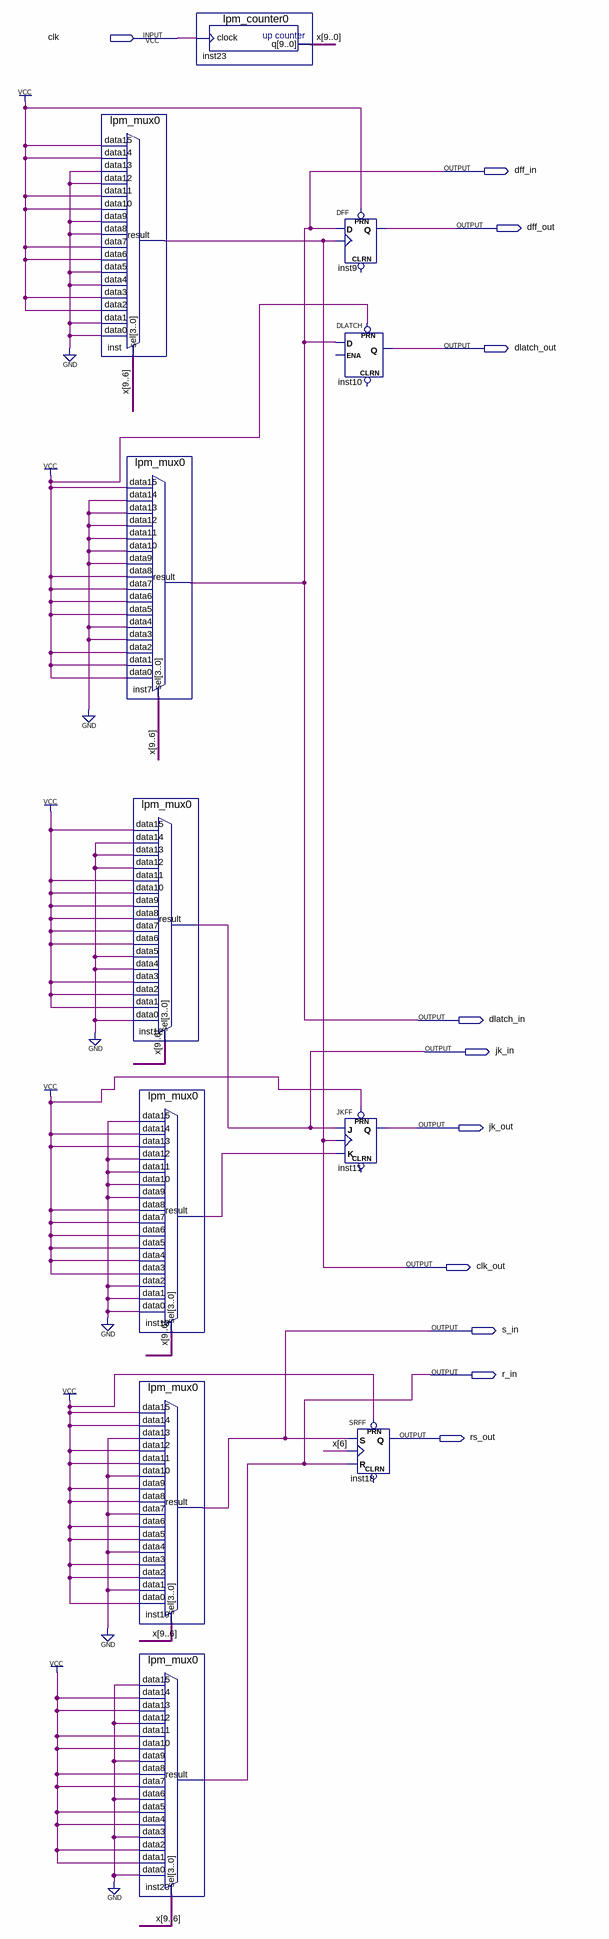
[diagram p0: schematic sheet]
// Quartus schematic Laba_4.bdf as structural Verilog: 11 symbols, 11 pins
module Laba_4 (
  input  clk,
  output dff_in,
  output dff_out,
  output dlatch_out,
  output dlatch_in,
  output jk_in,
  output jk_out,
  output clk_out,
  output s_in,
  output r_in,
  output rs_out
);

  wire inst13_result;
  wire [9:0] x;

  lpm_mux0 inst (
    .data15(1'b1), .data14(1'b1), .data13(1'b0), .data12(1'b0), .data11(1'b1), .data10(1'b1), .data9(1'b0),
    .data8(1'b0), .data7(1'b1), .data6(1'b1), .data5(1'b0), .data4(1'b0), .data3(1'b1), .data2(1'b1),
    .data1(1'b0), .data0(1'b0), .sel(x[9:6]), .result(clk_out));
  lpm_mux0 inst7 (
    .data15(1'b1), .data14(1'b0), .data13(1'b0), .data12(1'b0), .data11(1'b0), .data10(1'b0), .data9(1'b0),
    .data8(1'b1), .data7(1'b1), .data6(1'b1), .data5(1'b1), .data4(1'b0), .data3(1'b0), .data2(1'b1),
    .data1(1'b1), .data0(1'b1), .sel(x[9:6]), .result(dff_in));
  lpm_mux0 inst12 (
    .data15(1'b1), .data14(1'b0), .data13(1'b0), .data12(1'b0), .data11(1'b1), .data10(1'b1), .data9(1'b1),
    .data8(1'b1), .data7(1'b1), .data6(1'b1), .data5(1'b0), .data4(1'b0), .data3(1'b1), .data2(1'b1),
    .data1(1'b1), .data0(1'b0), .sel(x[9:6]), .result(jk_in));
  lpm_mux0 inst13 (
    .data15(1'b0), .data14(1'b1), .data13(1'b1), .data12(1'b0), .data11(1'b0), .data10(1'b0), .data9(1'b0),
    .data8(1'b1), .data7(1'b1), .data6(1'b1), .data5(1'b1), .data4(1'b1), .data3(1'b1), .data2(1'b0),
    .data1(1'b0), .data0(1'b0), .sel(x[9:6]), .result(inst13_result));
  lpm_mux0 inst19 (
    .data15(1'b1), .data14(1'b1), .data13(1'b0), .data12(1'b1), .data11(1'b1), .data10(1'b0), .data9(1'b1),
    .data8(1'b1), .data7(1'b0), .data6(1'b1), .data5(1'b1), .data4(1'b0), .data3(1'b1), .data2(1'b1),
    .data1(1'b0), .data0(1'b1), .sel(x[9:6]), .result(s_in));
  lpm_mux0 inst20 (
    .data15(1'b0), .data14(1'b1), .data13(1'b1), .data12(1'b0), .data11(1'b1), .data10(1'b1), .data9(1'b0),
    .data8(1'b1), .data7(1'b1), .data6(1'b0), .data5(1'b1), .data4(1'b1), .data3(1'b0), .data2(1'b1),
    .data1(1'b1), .data0(1'b0), .sel(x[9:6]), .result(r_in));
  lpm_counter0 inst23 (.clock(clk), .q(x));
  DFF inst9 (.CLK(clk_out), .D(dff_in), .PRN(1'b1), .Q(dff_out));  // open: CLRN
  DLATCH inst10 (.D(dff_in), .PRN(1'b1), .Q(dlatch_out));  // open: CLRN, ENA
  JKFF inst11 (.PRN(1'b1), .K(inst13_result), .J(jk_in), .CLK(clk_out), .Q(jk_out));  // open: CLRN
  SRFF inst18 (.PRN(1'b1), .S(s_in), .R(r_in), .CLK(x[6]), .Q(rs_out));  // open: CLRN

  assign dlatch_in = dff_in;
endmodule
